# EAGLE board Motherboard (EAGLE 6.2), part 1 of 2
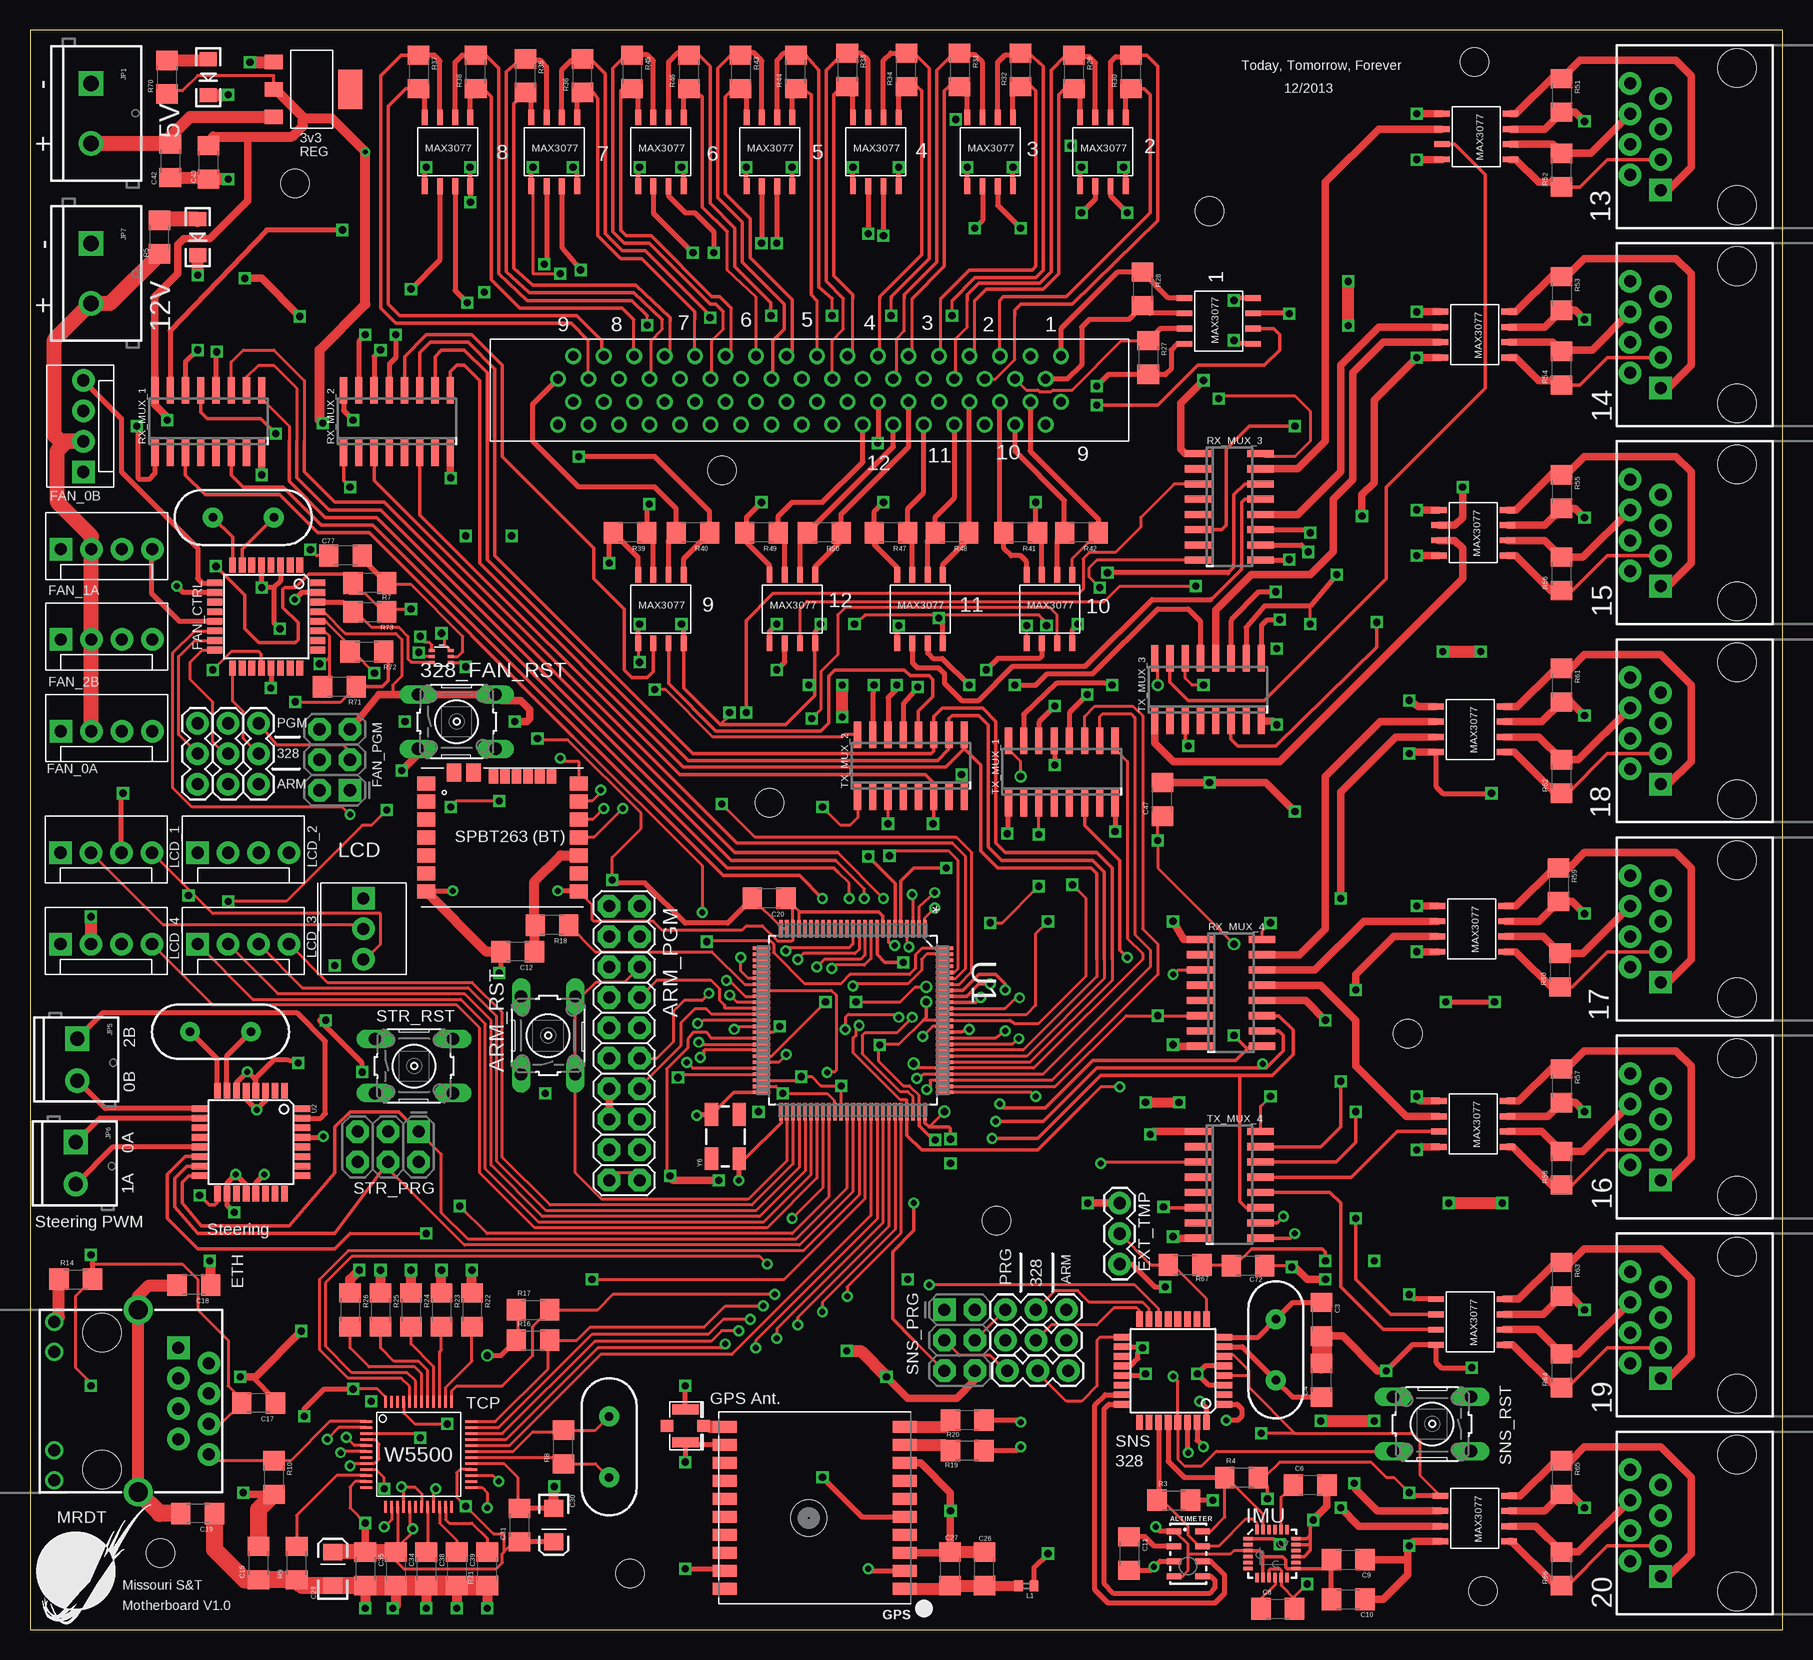
[diagram p9: board, top side]
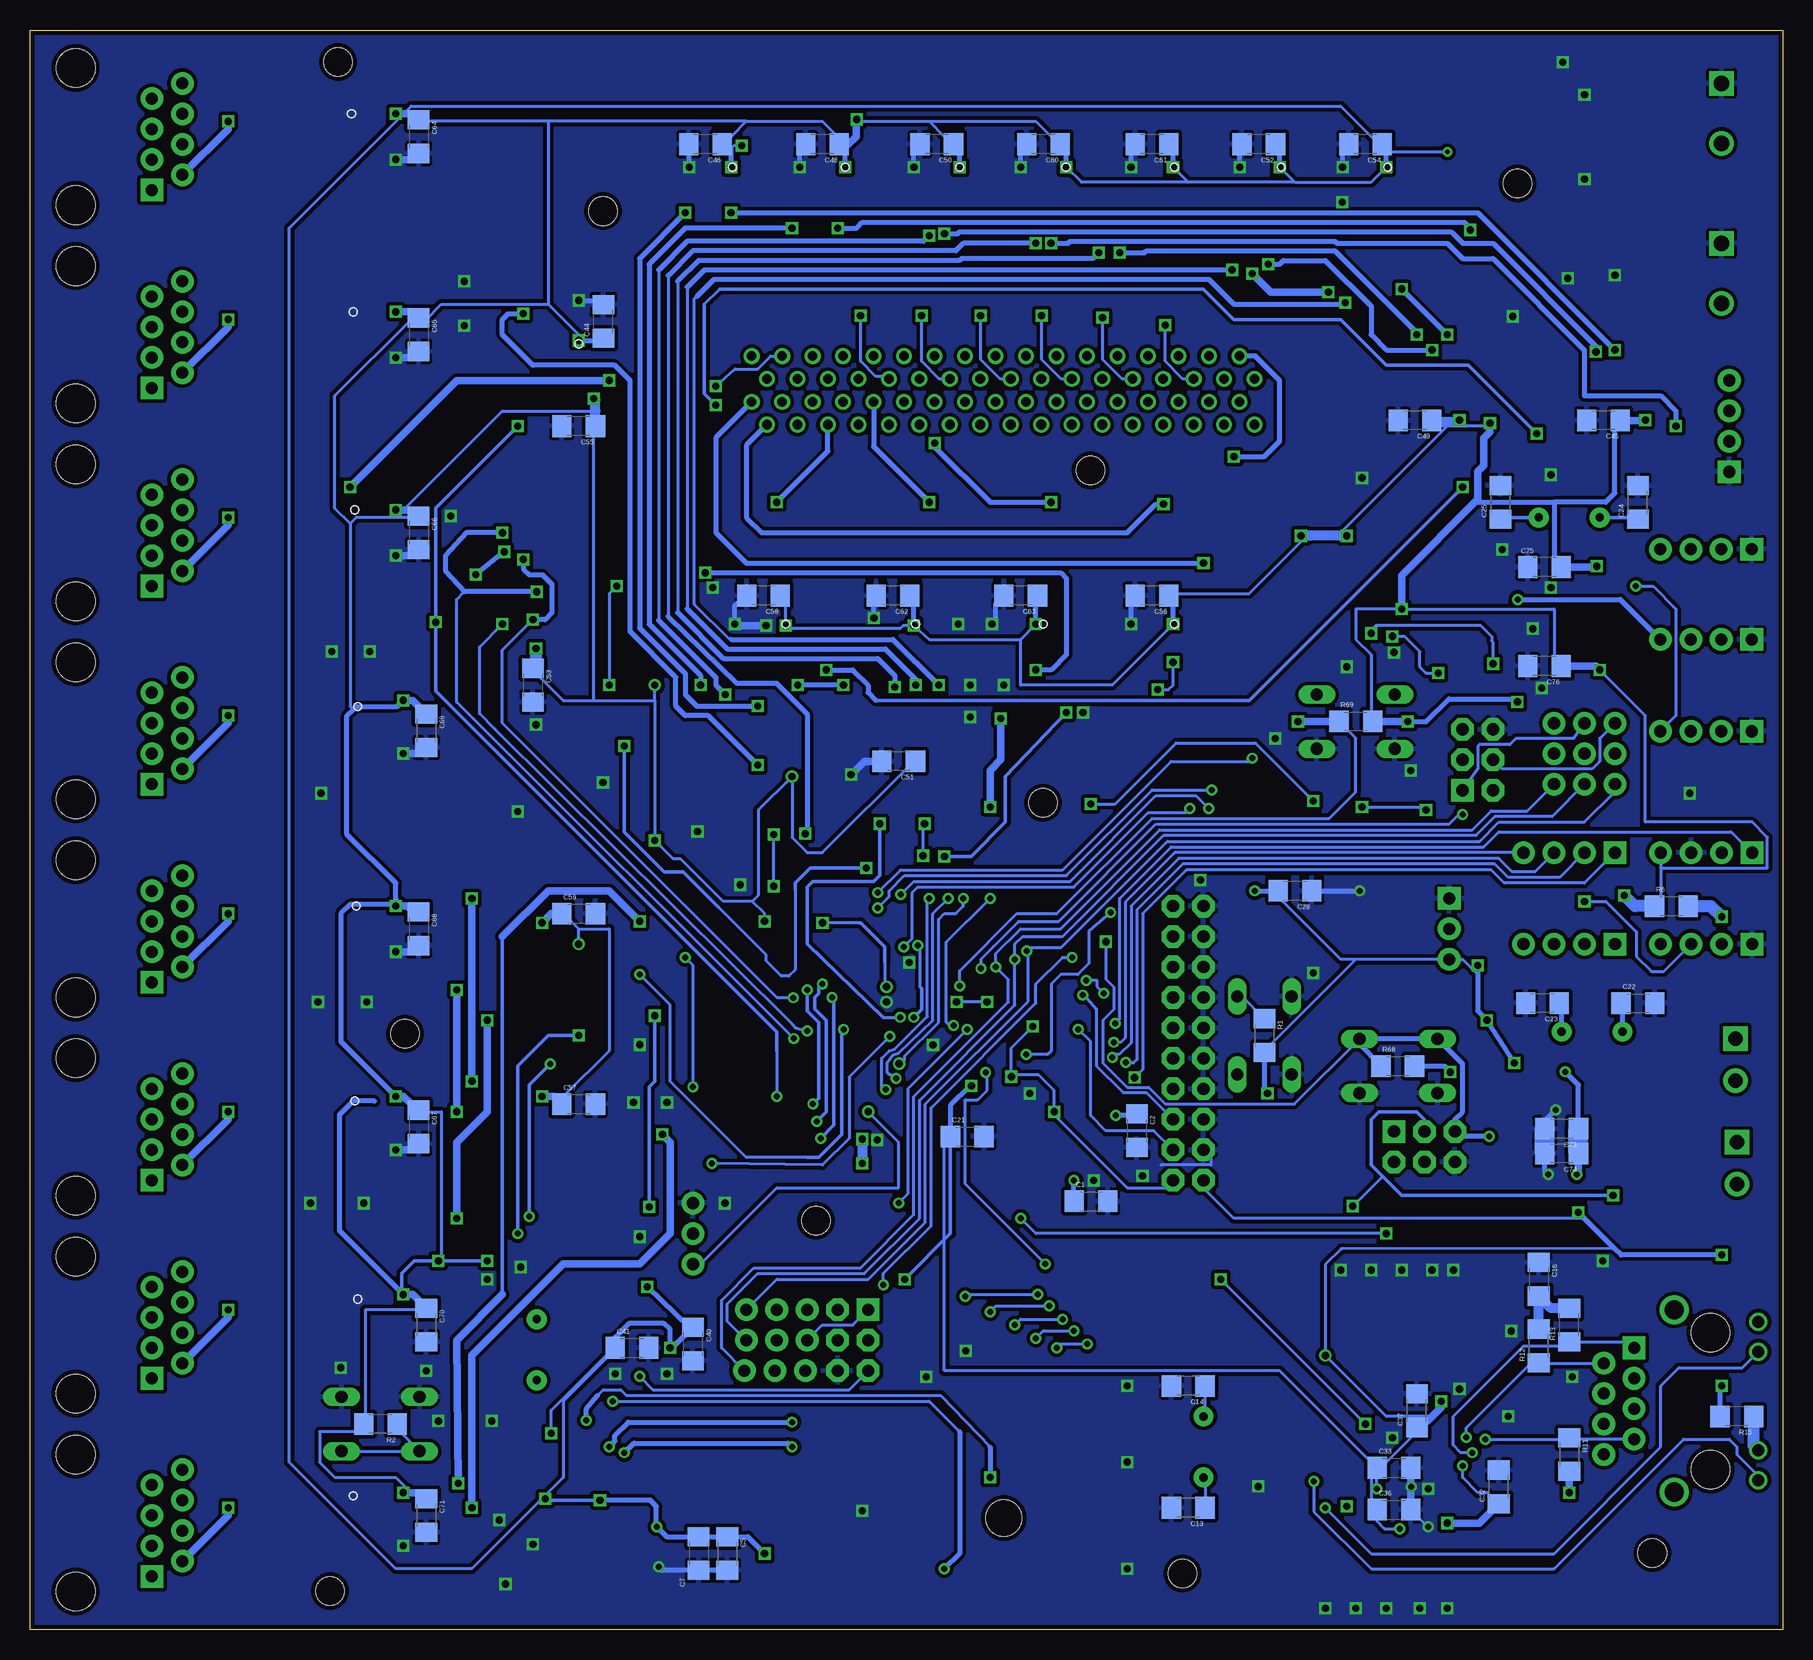
[diagram p10: board, bottom side, seen from below]

Size 146.05 x 133.35 mm. Coordinates in mm from the lower left corner, seen from the top.
Outline: 0,0 146.05,0 146.05,133.35 0,133.35 0,0
Copper layers (1*16): Top 0.035559375mm / dielectric 1.501140625mm / Bottom 0.035559375mm
Design rules "default": minimum track width 10mil, minimum drill 15mil, track to track 6mil, track to pad 6mil, pad to pad 6mil, via to via 6mil, smd to smd 6mil, copper to edge 15mil, drill to drill 8mil, minimum pad ring 10mil, minimum via ring 8mil, stop-mask expansion 4mil, vias tented up to drill 0mil, thermal gap 10mil
Holes 2.36 mm at 10.86,6.39 49.99,4.68 121.07,3.22 120.38,130.69 22.08,120.57 61.64,68.93 57.66,96.66 80.56,34.1 114.81,49.67 98.3,118.25
tRestrict: area 1,19.1 to 8.4,19.1

## Footprints (pad centres in the part's own frame; a part is rotated, then mirrored left to right if it is on the bottom)
B3F-10XX = drill 1.016 long: 1 -3.251,2.261; 2 3.251,2.261; 3 -3.251,-2.261; 4 3.251,-2.261
LGA8 = smd 1.2 x 0.5: 1 -1.2,1.875; 2 -1.2,0.625; 3 -1.2,-0.625; 4 -1.2,-1.875; 5 1.2,-1.875; 6 1.2,-0.625; 7 1.2,0.625; 8 1.2,1.875
SPBT2632C2A = smd 1.2 x 1.5: BOOT 3,6.37; CTS 0,6.37; GND 4.5,-6.37; GPIO1 -4.5,-6.37; GPIO2 -3,-6.37; GPIO3 -1.5,-6.37; GPIO4 0,-6.37; GPIO5 1.5,-6.37; GPIO6 3,-6.37; RESET 1.5,6.37; RTS -1.5,6.37; RXD -3,6.37; TXD -4.5,6.37; VIN 4.5,6.37 | smd 1.5 x 1.2: GPIO7 -5.4,-4.05; LPO -5.4,-2.4 | smd 1.2 x 0.8: NC -5.1,4.075; NC1 -5.1,3.11; NC2 -5.1,2.145; NC3 -5.1,1.18; NC4 -5.1,0.215; NC5 -5.1,-0.75
1206 = smd 1.6 x 1.8: 1 -1.4,0; 2 1.4,0
EIA3216 = smd 1.4 x 1.6: A 1.4,0; C -1.4,0
LED-1206 = smd 1.2 x 1.4: A -1.5,0; C 1.5,0
FGPMMOPA6H = smd 2 x 1: P$1 -7.5,6.75; P$2 -7.5,5.25; P$3 -7.5,3.75; P$4 -7.5,2.25; P$5 -7.5,0.75; P$6 -7.5,-0.75; P$7 -7.5,-2.25; P$8 -7.5,-3.75; P$9 -7.5,-5.25; P$10 -7.5,-6.75; P$11 7.5,-6.75; P$12 7.5,-5.25; P$13 7.5,-3.75; P$14 7.5,-2.25; P$15 7.5,-0.75; P$16 7.5,0.75; P$17 7.5,2.25; P$18 7.5,3.75; P$19 7.5,5.25; P$20 7.5,6.75 | hole 3: 0.5,0.85
QFN-24-NP = smd 0.8 x 0.3: 1 -2,1.25; 2 -2,0.75; 3 -2,0.25; 4 -2,-0.25; 5 -2,-0.75; 6 -2,-1.25; 13 2,-1.25; 14 2,-0.75; 15 2,-0.25; 16 2,0.25; 17 2,0.75; 18 2,1.25 | smd 0.3 x 0.8: 7 -1.25,-2; 8 -0.75,-2; 9 -0.25,-2; 10 0.25,-2; 11 0.75,-2; 12 1.25,-2; 19 1.25,2; 20 0.75,2; 21 0.25,2; 22 -0.25,2; 23 -0.75,2; 24 -1.25,2
2X3-NS = drill 1.016 pad 1.88 square: 1 -2.54,-1.27 | drill 1.016 pad 1.88 octagon: 2 -2.54,1.27; 3 0,-1.27; 4 0,1.27; 5 2.54,-1.27; 6 2.54,1.27
U.FL = smd 2.2 x 0.85: P$1 0,1.375; P$2 0,-1.375 | smd 1.05 x 1: P$3 1.525,0; P$4 -1.525,0
MAGJACK = drill 1 pad 1.88 square: 1 3.175,17.445 | drill 1 pad 1.88: 2 4.445,19.985; 3 5.715,17.445; 4 6.985,19.985; 5 8.255,17.445; 6 9.525,19.985; 7 10.795,17.445; 8 12.065,19.985 | drill 1 pad 1.27: 9 1,7.1; 10 3.5,7.1; 11 11.7,7.1; 12 14.2,7.1 | drill 1.6 pad 2.184: M1 0,14.1; M2 15.2,14.1 | hole 3.2: 1.905,11.095; 13.335,11.095
SCREWTERMINAL-5MM-2 = drill 1.3 pad 2.032 square: 1 0,0 | drill 1.3 pad 2.032: 2 5,0
1X03 = drill 1.016 pad 1.88: 1 0,0; 2 2.54,0; 3 5.08,0
MOLEX-1X4 = drill 1.016 pad 1.88 square: 1 0,0 | drill 1.016 pad 1.88: 2 2.54,0; 3 5.08,0; 4 7.62,0
SCREWTERMINAL-3.5MM-2 = drill 1.2 pad 2.032 square: 1 0,0 | drill 1.2 pad 2.032: 2 3.5,0
2X10 = drill 1.016 pad 1.88 octagon: 1 -11.43,-1.27; 2 -11.43,1.27; 3 -8.89,-1.27; 4 -8.89,1.27; 5 -6.35,-1.27; 6 -6.35,1.27; 7 -3.81,-1.27; 8 -3.81,1.27; 9 -1.27,-1.27; 10 -1.27,1.27; 11 1.27,-1.27; 12 1.27,1.27; 13 3.81,-1.27; 14 3.81,1.27; 15 6.35,-1.27; 16 6.35,1.27; 17 8.89,-1.27; 18 8.89,1.27; 19 11.43,-1.27; 20 11.43,1.27
0402 = smd 0.7 x 0.9: 1 -0.65,0; 2 0.65,0
MAX3070E = smd 0.49 x 1.3: A -1.905,2.857; B -0.635,2.857; DI 0.635,-2.857; GND 1.905,-2.857; RO -0.635,-2.857; VCC -1.905,-2.857; Y 1.905,2.857; Z 0.635,2.857
SOIC16N = smd 0.6 x 2.2: A 1.905,2.6; B 3.175,2.6; C 4.445,2.6; EN 1.905,-2.6; GND 4.445,-2.6; NC 3.175,-2.6; VCC -4.445,2.6; X -1.905,-2.6; X0 -0.635,2.6; X1 -1.905,2.6; X2 -3.175,2.6; X3 0.635,2.6; X4 -4.445,-2.6; X5 0.635,-2.6; X6 -3.175,-2.6; X7 -0.635,-2.6
QFP50P1600X1600X170-100N = smd 1.473 x 0.305: 1 -7.62,5.994; 2 -7.62,5.512; 3 -7.62,5.004; 4 -7.62,4.496; 5 -7.62,3.988; 6 -7.62,3.505; 7 -7.62,2.997; 8 -7.62,2.489; 9 -7.62,2.007; 10 -7.62,1.499; 11 -7.62,0.991; 12 -7.62,0.508; 13 -7.62,0; 14 -7.62,-0.508; 15 -7.62,-0.991; 16 -7.62,-1.499; 17 -7.62,-2.007; 18 -7.62,-2.489; 19 -7.62,-2.997; 20 -7.62,-3.505; 21 -7.62,-3.988; 22 -7.62,-4.496; 23 -7.62,-5.004; 24 -7.62,-5.512; 25 -7.62,-5.994; 51 7.62,-5.994; 52 7.62,-5.512; 53 7.62,-5.004; 54 7.62,-4.496; 55 7.62,-3.988; 56 7.62,-3.505; 57 7.62,-2.997; 58 7.62,-2.489; 59 7.62,-2.007; 60 7.62,-1.499; 61 7.62,-0.991; 62 7.62,-0.508; 63 7.62,0; 64 7.62,0.508; 65 7.62,0.991; 66 7.62,1.499; 67 7.62,2.007; 68 7.62,2.489; 69 7.62,2.997; 70 7.62,3.505; 71 7.62,3.988; 72 7.62,4.496; 73 7.62,5.004; 74 7.62,5.512; 75 7.62,5.994 | smd 0.305 x 1.473: 26 -5.994,-7.62; 27 -5.512,-7.62; 28 -5.004,-7.62; 29 -4.496,-7.62; 30 -3.988,-7.62; 31 -3.505,-7.62; 32 -2.997,-7.62; 33 -2.489,-7.62; 34 -2.007,-7.62; 35 -1.499,-7.62; 36 -0.991,-7.62; 37 -0.508,-7.62; 38 0,-7.62; 39 0.508,-7.62; 40 0.991,-7.62; 41 1.499,-7.62; 42 2.007,-7.62; 43 2.489,-7.62; 44 2.997,-7.62; 45 3.505,-7.62; 46 3.988,-7.62; 47 4.496,-7.62; 48 5.004,-7.62; 49 5.512,-7.62; 50 5.994,-7.62; 76 5.994,7.62; 77 5.512,7.62; 78 5.004,7.62; 79 4.496,7.62; 80 3.988,7.62; 81 3.505,7.62; 82 2.997,7.62; 83 2.489,7.62; 84 2.007,7.62; 85 1.499,7.62; 86 0.991,7.62; 87 0.508,7.62; 88 0,7.62; 89 -0.508,7.62; 90 -0.991,7.62; 91 -1.499,7.62; 92 -2.007,7.62; 93 -2.489,7.62; 94 -2.997,7.62; 95 -3.505,7.62; 96 -3.988,7.62; 97 -4.496,7.62; 98 -5.004,7.62; 99 -5.512,7.62; 100 -5.994,7.62
TQFP32-08 = smd 1.27 x 0.559: 1 -4.293,2.8; 2 -4.293,2; 3 -4.293,1.2; 4 -4.293,0.4; 5 -4.293,-0.4; 6 -4.293,-1.2; 7 -4.293,-2; 8 -4.293,-2.8; 17 4.293,-2.8; 18 4.293,-2; 19 4.293,-1.2; 20 4.293,-0.4; 21 4.293,0.4; 22 4.293,1.2; 23 4.293,2; 24 4.293,2.8 | smd 0.559 x 1.27: 9 -2.8,-4.293; 10 -2,-4.293; 11 -1.2,-4.293; 12 -0.4,-4.293; 13 0.4,-4.293; 14 1.2,-4.293; 15 2,-4.293; 16 2.8,-4.293; 25 2.8,4.293; 26 2,4.293; 27 1.2,4.293; 28 0.4,4.293; 29 -0.4,4.293; 30 -1.2,4.293; 31 -2,4.293; 32 -2.8,4.293
SOT563-2 = smd 0.508 x 0.249: 1 -0.8,0.498; 2 -0.8,0.003; 3 -0.8,-0.506; 4 0.776,-0.506; 5 0.776,0.003; 6 0.776,0.498
RJ45-8 = drill 1 pad 1.88 square: 1 -4.445,6.35 | drill 1 pad 1.88: 2 -3.175,8.89; 3 -1.905,6.35; 4 -0.635,8.89; 5 0.635,6.35; 6 1.905,8.89; 7 3.175,6.35; 8 4.445,8.89 | hole 3.2: -5.715,0; 5.715,0
LD1117SOT-223 = smd 3.3 x 2: (VOUT) 0,3.2 | smd 1.2 x 1.5: GND -2.3,-3.2; VIN 2.3,-3.2; VOUT 0,-3.2
3362U = drill 1.016 pad 1.88 square: P$1 0,2.54 | drill 1.016 pad 1.88: P$2 2.54,2.54; P$3 5.08,2.54
W5500 = smd 0.22 x 1: 1V20 1.75,-4.375; AGND2 -2.25,-4.375; AGND3 -1.25,-4.375; AGND4 0.25,-4.375; AGND5 -2.75,4.375; AVDD3 -1.75,-4.375; AVDD4 -0.75,-4.375; AVDD5 1.25,-4.375; NC2 -2.75,-4.375; NC3 -1.75,4.375; NC4 -2.25,4.375; PMODE0 -1.25,4.375; PMODE1 -0.75,4.375; PMODE2 -0.25,4.375; RSTN 2.75,4.375; RSVD 2.25,-4.375; RSVD2 2.25,4.375; RSVD3 1.75,4.375; RSVD4 1.25,4.375; RSVD5 0.75,4.375; RSVD6 0.25,4.375; SPDLED 2.75,-4.375; TOCAP 0.75,-4.375; VBG -0.25,-4.375 | smd 1 x 0.22: ACTLED 4.375,-1.75; AGND -4.375,1.75; AGND1 -4.375,-1.25; AVDD -4.375,1.25; AVDD1 -4.375,-0.75; AVDD2 -4.375,-2.25; DNC -4.375,-0.25; DUPLED 4.375,-2.25; EXRES1 -4.375,-1.75; GND 4.375,-0.75; INTN 4.375,2.75; LINKLED 4.375,-2.75; MISO 4.375,1.75; MOSI 4.375,2.25; NC -4.375,-2.75; RXN -4.375,0.75; RXP -4.375,0.25; SCLK 4.375,1.25; SCSN 4.375,0.75; TXN -4.375,2.75; TXP -4.375,2.25; VDD 4.375,-1.25; XI/CLKIN 4.375,-0.25; XO 4.375,0.25
60050685100 = drill 0.8: 1 47.555,7.107; 2 46.285,5.202; 3 45.015,7.107; 4 43.745,5.202; 5 42.475,7.107; 6 41.205,5.202; 7 39.935,7.107; 8 38.665,5.202; 9 37.395,7.107; 10 36.125,5.202; 11 34.855,7.107; 12 33.585,5.202; 13 32.315,7.107; 14 31.045,5.202; 15 29.775,7.107; 16 28.505,5.202; 17 27.235,7.107; 18 25.965,5.202; 19 24.695,7.107; 20 23.425,5.202; 21 22.155,7.107; 22 20.885,5.202; 23 19.615,7.107; 24 18.345,5.202; 25 17.075,7.107; 26 15.805,5.202; 27 14.535,7.107; 28 13.265,5.202; 29 11.995,7.107; 30 10.725,5.202; 31 9.455,7.107; 32 8.185,5.202; 33 6.915,7.107; 34 5.645,5.202; 35 47.555,3.297; 36 46.285,1.393; 37 45.015,3.297; 38 43.745,1.393; 39 42.475,3.297; 40 41.205,1.393; 41 39.935,3.297; 42 38.665,1.393; 43 37.395,3.297; 44 36.125,1.393; 45 34.855,3.297; 46 33.585,1.393; 47 32.315,3.297; 48 31.045,1.393; 49 29.775,3.297; 50 28.505,1.393; 51 27.235,3.297; 52 25.965,1.393; 53 24.695,3.297; 54 23.425,1.393; 55 22.155,3.297; 56 20.885,1.393; 57 19.615,3.297; 58 18.345,1.393; 59 17.075,3.297; 60 15.805,1.393; 61 14.535,3.297; 62 13.265,1.393; 63 11.995,3.297; 64 10.725,1.393; 65 9.455,3.297; 66 8.185,1.393; 67 6.915,3.297; 68 5.645,1.393
HC49US = drill 0.7 pad 1.651: 1 -2.54,0; 2 2.54,0
CRYSTAL-SMD-5X3 = smd 1.9 x 1.1: 1 -1.85,-1.15; 2 1.85,-1.15; 3 1.85,1.15; 4 -1.85,1.15

## Placement (x,y rotation side)
328_FAN_RST  [B3F-10XX]  35.56,75.69 0 top
328_RST  [B3F-10XX]  116.84,17.14 180 top
328_STR_RST  [B3F-10XX]  32,46.99 0 top
ALTIMETER  MPL3115A2LGA8  [LGA8]  96.52,6.35 0 top
ARM_RST  [B3F-10XX]  43.18,49.53 90 top
BLUETOOTH  SPBT2632C2A  [SPBT2632C2A]  39.37,66.04 270 top
C1  20pF  [1206]  57.63,35.72 0 bottom
C2  20pF  [1206]  53.82,41.59 270 bottom
C3  22pF  [1206]  107.63,25.88 270 top
C4  22pF  [1206]  107.63,20.8 90 top
C5  100nF  [1206]  87.95,6.35 270 bottom
C6  2.2nF  [1206]  106.68,12.06 0 top
C7  10uF  [1206]  90.33,6.35 270 bottom
C8  0.1uF  [1206]  103.98,1.75 0 top
C9  10nF  [1206]  109.86,5.84 0 top
C10  0.1uF  [1206]  109.86,2.54 0 top
C11  100nF  [1206]  91.6,6.35 270 top
C12  0.1uF  [1206]  40.64,56.52 180 top
C13  18pF  [1206]  49.53,10.16 180 bottom
C14  18pF  [1206]  49.53,20.32 180 bottom
C15  .1uF  [1206]  19.05,5.56 90 top
C16  .1uF  [1206]  20.32,29.21 270 bottom
C17  .1uF  [1206]  19.05,18.89 180 top
C18  .1uF  [1206]  13.65,28.73 180 top
C19  .1uF  [1206]  13.97,9.68 180 top
C20  0.1uF  [1206]  61.59,60.96 180 top
C21  0.1uF  [1206]  67.94,41.12 0 bottom
C22  22pF  [1206]  12.06,52.23 0 bottom
C23  22pF  [1206]  20,52.23 180 bottom
C24  22pF  [1206]  12.06,93.98 90 bottom
C25  22pF  [1206]  23.5,93.98 90 bottom
C26  1uF  [1206]  79.53,5.08 90 top
C27  0.01uF  [1206]  76.68,5.08 90 top
C28  0.1uF  [1206]  40.64,61.59 180 bottom
C29  10uF/16V  [EIA3216]  25.24,5.08 90 top
C30  10uF/16V  [EIA3216]  43.66,8.73 270 top
C31  0.1uF  [1206]  40.8,8.73 90 top
C32  0.1uF  [1206]  23.65,11.91 90 bottom
C33  0.1uF  [1206]  32.38,13.49 0 bottom
C34  0.1uF  [1206]  30.48,5.08 270 top
C35  0.1uF  [1206]  27.94,5.08 270 top
C36  0.1uF  [1206]  32.38,10 0 bottom
C37  0.1uF  [1206]  30.48,18.26 90 bottom
C38  4.7uF  [1206]  33.02,5.08 270 top
C39  10nF  [1206]  35.56,5.08 270 top
C40  0.1uF  [1206]  90.81,23.81 270 bottom
C41  0.1uF  [1206]  95.89,23.5 0 bottom
C42  100nF  [1206]  11.68,122.43 270 top
C43  10uF  [1206]  14.86,122.3 270 top
C44  0.1uF  [1206]  98.27,109.06 90 bottom
C45  0.1uF  [1206]  14.92,100.81 180 bottom
C46  0.1uF  [1206]  89.76,123.83 180 bottom
C47  0.1uF  [1206]  94.36,69.22 90 top
C48  0.1uF  [1206]  80.01,123.83 180 bottom
C49  0.1uF  [1206]  30.64,100.81 180 bottom
C50  0.1uF  [1206]  70.48,123.83 180 bottom
C51  0.1uF  [1206]  73.66,72.39 180 bottom
C52  0.1uF  [1206]  43.66,123.83 180 bottom
C53  0.1uF  [1206]  104.14,78.74 270 bottom
C54  0.1uF  [1206]  34.77,123.83 180 bottom
C55  0.1uF  [1206]  100.33,100.33 180 bottom
C56  0.1uF  [1206]  52.55,86.2 180 bottom
C57  0.1uF  [1206]  100.33,43.81 0 bottom
C58  0.1uF  [1206]  84.93,86.2 180 bottom
C59  0.1uF  [1206]  100.33,59.69 0 bottom
C60  0.1uF  [1206]  61.59,123.83 180 bottom
C61  0.1uF  [1206]  52.55,123.83 180 bottom
C62  0.1uF  [1206]  74.14,86.2 180 bottom
C63  0.1uF  [1206]  63.5,86.2 180 bottom
C64  0.1uF  [1206]  113.67,124.46 270 bottom
C65  0.1uF  [1206]  113.67,107.95 270 bottom
C66  0.1uF  [1206]  113.67,91.44 270 bottom
C67  0.1uF  [1206]  113.67,41.91 270 bottom
C68  0.1uF  [1206]  113.67,58.42 270 bottom
C69  0.1uF  [1206]  113.03,74.93 270 bottom
C70  0.1uF  [1206]  113.03,25.4 270 bottom
C71  0.1uF  [1206]  113.03,9.53 270 bottom
C72  100nF  [1206]  101.49,30.36 0 top
C73  0.1uF  [1206]  18.41,41.75 180 bottom
C74  0.1uF  [1206]  18.41,39.69 180 bottom
C75  0.1uF  [1206]  19.84,88.58 180 bottom
C76  0.1uF  [1206]  19.84,80.33 180 bottom
C77  0.1uF  [1206]  26.29,89.53 180 top
D1  GREEN  [LED-1206]  14.86,129.41 270 top
D2  GREEN  [LED-1206]  13.97,116.08 270 top
GPS  [FGPMMOPA6H]  65.41,10.16 180 top
IMU  [QFN-24-NP]  103.5,6.35 0 top
J1  AVR_SPI_PRG_6NS  [2X3-NS]  77.47,24.13 270 top
J2  U.FL  [U.FL]  54.61,16.99 0 top
J3  MAGJACK  [MAGJACK]  -5.08,26.67 270 top
J4  AVR_SPI_PRG_6NS  [2X3-NS]  29.84,40.26 180 top
J5  AVR_SPI_PRG_6NS  [2X3-NS]  25.4,72.52 90 top
JP1  M025MM  [SCREWTERMINAL-5MM-2]  5.08,128.91 270 top
JP2  [1X03]  90.81,35.56 270 top
JP3  [MOLEX-1X4]  2.54,64.77 0 top
JP4  [MOLEX-1X4]  2.57,90.07 0 top
JP5  M023.5MM  [SCREWTERMINAL-3.5MM-2]  3.94,49.28 270 top
JP6  M023.5MM  [SCREWTERMINAL-3.5MM-2]  3.81,40.64 270 top
JP7  M025MM  [SCREWTERMINAL-5MM-2]  5.08,115.57 270 top
JP8  [MOLEX-1X4]  2.57,74.9 0 top
JP9  [MOLEX-1X4]  13.97,64.77 0 top
JP10  [MOLEX-1X4]  2.57,82.55 0 top
JP11  [MOLEX-1X4]  4.45,96.52 90 top
JP12  [MOLEX-1X4]  13.97,57.15 0 top
JP13  [MOLEX-1X4]  2.54,57.15 0 top
JP15  JUMPER-3PTH  [1X03]  16.51,70.48 90 top
JP16  JUMPER-3PTH  [1X03]  13.97,70.48 90 top
JP17  JUMPER-3PTH  [1X03]  19.05,70.48 90 top
JP18  JUMPER-3PTH  [1X03]  86.36,26.67 180 top
JP19  JUMPER-3PTH  [1X03]  86.36,24.13 180 top
JP20  JUMPER-3PTH  [1X03]  86.52,21.59 180 top
JTAG_CON  M10X2  [2X10]  49.53,48.9 90 top
L1  BML15HB121SN1  [0402]  83.03,3.65 180 top
R1  10k  [1206]  43.18,49.53 270 bottom
R2  10k  [1206]  116.84,17.14 180 bottom
R3  10k  [1206]  95.31,10.79 0 top
R4  10k  [1206]  100.97,12.7 0 top
R5  330  [1206]  10.79,116.08 90 top
R6  100  [1206]  9.27,60.33 0 bottom
R7  1k  [1206]  28.32,87.25 180 top
R8  1M  [1206]  44.45,15.24 90 top
R9  12.4K  [1206]  22.23,5.56 90 top
R10  51  [1206]  20.32,12.7 270 top
R11  51  [1206]  17.78,14.61 270 bottom
R12  51  [1206]  20.32,23.65 90 bottom
R13  51  [1206]  17.78,25.4 90 bottom
R14  200  [1206]  3.81,29.21 0 top
R15  200  [1206]  3.81,17.78 180 bottom
R16  10K  [1206]  41.91,24.13 0 top
R17  10K  [1206]  41.91,26.67 0 top
R18  10k  [1206]  43.5,58.74 180 top
R19  330  [1206]  78.11,14.92 180 top
R20  330  [1206]  78.11,17.46 180 top
R21  10k  [1206]  38.1,5.08 90 top
R22  10k  [1206]  36.83,26.67 270 top
R23  10k  [1206]  34.29,26.67 270 top
R24  10k  [1206]  31.75,26.67 270 top
R25  10k  [1206]  29.21,26.67 270 top
R26  10k  [1206]  26.67,26.67 270 top
R27  120  [1206]  93.19,106.05 270 top
R28  120  [1206]  92.71,111.76 270 top
R29  120  [1206]  87,129.86 270 top
R30  120  [1206]  91.76,129.86 90 top
R31  120  [1206]  77.47,130.02 270 top
R32  120  [1206]  82.55,130.02 90 top
R33  120  [1206]  68.1,130.02 270 top
R34  120  [1206]  73.03,130.02 90 top
R35  120  [1206]  41.27,129.54 270 top
R36  120  [1206]  46.04,129.54 90 top
R37  120  [1206]  32.38,129.86 270 top
R38  120  [1206]  37.15,129.86 90 top
R39  120  [1206]  50.01,91.44 180 top
R40  120  [1206]  55.24,91.44 180 top
R41  120  [1206]  82.55,91.44 180 top
R42  120  [1206]  87.63,91.44 180 top
R43  120  [1206]  59.21,129.86 270 top
R44  120  [1206]  63.82,129.86 90 top
R45  120  [1206]  50.16,129.86 270 top
R46  120  [1206]  54.93,129.86 90 top
R47  120  [1206]  71.75,91.44 180 top
R48  120  [1206]  76.83,91.44 180 top
R49  120  [1206]  60.96,91.44 180 top
R50  120  [1206]  66.2,91.44 180 top
R51  120  [1206]  127.64,127.89 270 top
R52  120  [1206]  127.64,121.67 90 top
R53  120  [1206]  127.64,111.38 270 top
R54  120  [1206]  127.64,105.16 90 top
R55  120  [1206]  127.64,94.87 270 top
R56  120  [1206]  127.64,88.01 90 top
R57  120  [1206]  127.64,45.34 270 top
R58  120  [1206]  127.64,38.48 90 top
R59  120  [1206]  127.38,62.1 270 top
R60  120  [1206]  127.51,54.99 90 top
R61  120  [1206]  127.64,78.74 270 top
R62  120  [1206]  127.64,71.12 90 top
R63  120  [1206]  127.64,29.21 270 top
R64  120  [1206]  127.64,21.59 90 top
R65  120  [1206]  127.64,12.7 270 top
R66  120  [1206]  127.64,5.08 90 top
R67  1K  [1206]  96.27,30.42 0 top
R68  10k  [1206]  32.07,46.99 0 bottom
R69  10k  [1206]  35.56,75.72 0 bottom
R70  330  [1206]  11.43,129.41 90 top
R71  1k  [1206]  25.78,78.61 0 top
R72  1k  [1206]  28.07,81.53 0 top
R73  1k  [1206]  28.32,84.84 0 top
RS-485-1  MAX3077  [MAX3070E]  120.52,124.46 270 top
RS-485-2  MAX3077  [MAX3070E]  120.4,107.95 270 top
RS-485-3  MAX3077  [MAX3070E]  120.27,91.44 270 top
RS-485-4  MAX3077  [MAX3070E]  120.27,42.16 270 top
RS-485-5  MAX3077  [MAX3070E]  120.14,58.42 270 top
RS-485-6  MAX3077  [MAX3070E]  120.02,75.06 270 top
RS-485-7  MAX3077  [MAX3070E]  120.02,25.65 270 top
RS-485-8  MAX3077  [MAX3070E]  120.4,9.27 270 top
RS_TRANS_1  MAX3077  [MAX3070E]  99.06,109.09 90 top
RS_TRANS_2  MAX3077  [MAX3070E]  89.41,123.19 0 top
RS_TRANS_3  MAX3077  [MAX3070E]  80.01,123.19 0 top
RS_TRANS_4  MAX3077  [MAX3070E]  70.48,123.19 0 top
RS_TRANS_5  MAX3077  [MAX3070E]  43.69,123.19 0 top
RS_TRANS_6  MAX3077  [MAX3070E]  34.8,123.19 0 top
RS_TRANS_7  MAX3077  [MAX3070E]  52.58,85.09 0 top
RS_TRANS_8  MAX3077  [MAX3070E]  84.96,85.09 0 top
RS_TRANS_9  MAX3077  [MAX3070E]  61.63,123.19 0 top
RS_TRANS_10  MAX3077  [MAX3070E]  52.58,123.19 0 top
RS_TRANS_11  MAX3077  [MAX3070E]  74.17,85.09 0 top
RS_TRANS_12  MAX3077  [MAX3070E]  63.53,85.09 0 top
RX_MUX_1  8:1 Mux  [SOIC16N]  14.86,100.71 0 top
RX_MUX_2  8:1 Mux  [SOIC16N]  30.58,100.71 0 top
RX_MUX_3  8:1 Mux  [SOIC16N]  99.95,93.6 270 top
RX_MUX_4  8:1 Mux  [SOIC16N]  100.08,53.09 270 top
TX_MUX_1  8:1 Mux  [SOIC16N]  85.98,71.5 0 top
TX_MUX_2  8:1 Mux  [SOIC16N]  73.41,72.01 0 top
TX_MUX_3  8:1 Mux  [SOIC16N]  98.17,78.36 0 top
TX_MUX_4  8:1 Mux  [SOIC16N]  99.95,37.08 270 top
U1  MK10DN512ZVLL10  [QFP50P1600X1600X170-100N]  68.58,50.8 270 top
U2  ATMEGA328P  [TQFP32-08]  18.41,40.64 270 top
U3  ATMEGA328P  [TQFP32-08]  95.25,21.59 180 top
U4  ATMEGA328P  [TQFP32-08]  19.68,84.45 270 top
U5  TMP1021:1  [SOT563-2]  34.29,81.12 0 top
U$1  RJ45-8PTH  [RJ45-8]  142.24,124.46 90 top
U$2  LD1117  [LD1117SOT-223]  23.5,128.4 270 top
U$3  RJ45-8PTH  [RJ45-8]  142.24,107.95 90 top
U$4  RJ45-8PTH  [RJ45-8]  142.24,91.44 90 top
U$5  RJ45-8PTH  [RJ45-8]  142.24,41.91 90 top
U$6  RJ45-8PTH  [RJ45-8]  142.24,58.42 90 top
U$7  RJ45-8PTH  [RJ45-8]  142.24,74.93 90 top
U$8  RJ45-8PTH  [RJ45-8]  142.24,25.4 90 top
U$9  RJ45-8PTH  [RJ45-8]  142.24,8.89 90 top
U$10  10k  [3362U]  25.24,60.96 270 top
U$11  W5500  [W5500]  32.38,14.61 0 top
U$36  TB60050685100  [60050685100]  38.35,99.06 0 top
Y2  8MHz  [HC49US]  103.82,23.34 270 top
Y3  25MHz  [HC49US]  48.26,15.24 270 top
Y4  8MHz  [HC49US]  15.88,49.85 0 top
Y5  8MHz  [HC49US]  17.78,92.71 0 top
Y6  32MHz  [CRYSTAL-SMD-5X3]  57.94,41.12 90 top

## Tracks (layer width: path | path; a pad name or v marks a point on that pad's centre or on a via)
1_RX+  (via drill 0.6)
  Top 0.254: R27.2 92.42,104.93
  Top 0.406: RS_TRANS_1.A 95.6,107.19 95.09,106.68 95.09,105.09 94.61,104.62 93.22,104.62 R27.2 89.88,104.64 v88.9,103.66
  Bottom 0.254: v88.9,103.66 87.31,105.09 85.41,105.09 84.33,106.17 U$36.3
1_RX-
  Top 0.254: U$36.4 83.02,103.35 83.98,103.35 84.14,103.19 85.09,103.19 85.25,103.35 86.84,103.35 90.94,107.44 R27.1
  Top 0.406: RS_TRANS_1.B 94.2,108.46 R27.1
1_TX+
  Top 0.406: RS_TRANS_1.Y 94.87,111 R28.1 90.62,113.16 85.91,108.45 U$36.1
1_TX-
  Top 0.406: RS_TRANS_1.Z 93.34,109.73 R28.2 91.57,109.22 88.27,109.22 87.63,108.58 87.63,105.41 86.45,104.26 U$36.2
2_RX+
  Top 0.254: U$36.7 78.74,106.62 78.74,110.81
  Top 0.305: 78.74,110.81 79.69,111.76 84.45,111.76 85.72,113.03 85.72,127.95 86.23,128.46 R29.2
  Top 0.406: RS_TRANS_2.A 87.5,127.95 R29.2
2_RX-
  Top 0.254: U$36.8 77.15,104.4 77.15,107.63 78.11,108.58 78.11,110.81
  Top 0.305: 78.11,110.81 78.11,111.28 79.06,112.24 84.14,112.24 85.09,113.19 85.09,130.02 86.33,131.26 R29.1
  Top 0.406: RS_TRANS_2.B 88.77,130.62 88.27,131.13 87.12,131.13 R29.1
2_TX+
  Top 0.254: U$36.5 80.8,106.19 80.8,110.81
  Top 0.305: 80.8,110.81 81.12,111.12 86.36,111.12 93.34,118.11 93.34,127.95 92.84,128.46 R30.1
  Top 0.406: RS_TRANS_2.Y 91.31,128.01 R30.1
2_TX-
  Top 0.254: U$36.6 80.45,104.26 82.07,105.89 82.07,109.54
  Top 0.305: 82.07,109.54 82.07,110.01 82.55,110.49 86.84,110.49 93.98,117.47 93.98,130.33 93.06,131.26 R30.2
  Top 0.406: RS_TRANS_2.Z 90.04,130.68 90.49,131.13 91.63,131.13 R30.2
3_RX+
  Top 0.254: U$36.11 73.5,106.51 73.5,110.97
  Top 0.305: 73.5,110.97 76.2,113.67 76.2,128.27 76.55,128.62 R31.2
  Top 0.406: RS_TRANS_3.A 78.11,127.98 R31.2
3_RX-
  Top 0.254: U$36.12 72.23,104.61 72.23,107.63 72.87,108.27 72.87,110.97
  Top 0.305: 72.87,110.97 72.87,111.28 75.56,113.98 75.56,130.02 76.68,131.13 77.18,131.13 R31.1
  Top 0.406: R31.1 77.6,131.29 78.74,131.29 79.38,130.65 RS_TRANS_3.B
3_TX+
  Top 0.254: U$36.9 75.88,106.3 75.88,110.97
  Top 0.305: 75.88,110.97 78.26,113.35 83.5,113.35 83.82,113.67 83.82,128.27 83.47,128.62 R32.1
  Top 0.406: RS_TRANS_3.Y 81.92,127.98 R32.1
3_TX-  (via drill 0.6)
  Top 0.254: 82.68,131.29 R32.2 | v76.83,109.54 76.83,110.81
  Top 0.305: 76.83,110.81 78.74,112.71 83.82,112.71 84.45,113.35 84.45,130.33 83.21,131.42 R32.2
  Top 0.406: RS_TRANS_3.Z 80.64,130.65 81.28,131.29 82.42,131.29 R32.2
  Bottom 0.254: U$36.10 74.67,104.46 75.56,104.46 76.83,105.73 v76.83,109.54
4_RX+
  Top 0.254: U$36.15 68.58,106.62 68.58,110.97
  Top 0.305: 68.58,110.97 68.58,111.28 66.99,112.87 66.99,127.95 67.31,128.27 67.76,128.27 R33.2
  Top 0.406: RS_TRANS_4.A 68.58,128.14 R33.2
4_RX-
  Top 0.254: U$36.16 66.83,104.29 66.83,107.47 67.79,108.43 67.79,110.97
  Top 0.305: 67.79,110.97 66.36,112.39 66.36,130.02 67.76,131.42 R33.1
  Top 0.406: RS_TRANS_4.B 69.85,130.81 69.24,131.42 R33.1
4_TX+
  Top 0.254: U$36.13 70.8,106.3 70.8,110.97
  Top 0.305: 70.8,110.97 70.8,111.12 74.3,114.62 74.3,128.27 73.95,128.62 R34.1
  Top 0.406: RS_TRANS_4.Y 72.39,127.98 R34.1
4_TX-  (via drill 0.6)
  Top 0.254: v71.75,109.54 71.75,110.97
  Top 0.305: 71.75,110.97 71.75,111.12 74.93,114.3 74.93,130.18 73.69,131.42 R34.2
  Top 0.406: RS_TRANS_4.Z 71.12,130.81 71.73,131.42 R34.2
  Bottom 0.254: U$36.14 70.29,104.26 71.75,105.73 v71.75,109.54
5_RX+
  Top 0.305: U$36.19 63.5,106.62 63.5,110.87 60.01,114.36 60.01,117.63 57.94,119.7 57.94,127.79 58.61,128.46 R43.2
  Top 0.406: RS_TRANS_9.A 59.72,127.95 R43.2
5_RX-
  Top 0.305: U$36.20 61.91,104.4 61.91,107.47 62.87,108.43 62.87,110.01 62.87,110.49 59.37,113.98 59.37,117.32 57.31,119.38 57.31,130.18 58.39,131.26 R43.1
  Top 0.406: RS_TRANS_9.B 60.99,130.78 60.33,131.44 59.4,131.44 R43.1 59.66,130.81
5_TX+
  Top 0.254: U$36.17 65.59,110.78 65.56,110.81
  Top 0.305: 65.56,110.81 65.09,111.28 65.09,127.95 64.61,128.27 64,128.27 R44.1
  Top 0.406: RS_TRANS_9.Y 63.53,128.17 R44.1
5_TX-  (via drill 0.6)
  Top 0.254: v66.83,109.54 66.83,110.97
  Top 0.305: 66.83,110.97 65.72,111.92 65.72,130.02 64.64,131.26 R44.2
  Top 0.406: RS_TRANS_9.Z 62.26,130.84 62.87,131.44 63.63,131.44 R44.2
  Bottom 0.254: U$36.18 65.21,104.26 66.83,105.89 v66.83,109.54
6_RX+
  Top 0.254: U$36.23 58.42,106.62 58.42,110.17
  Top 0.305: 58.42,110.17 57.47,111.12 56.83,111.12 51.75,116.2 49.69,116.2 49.21,116.68 49.21,128.27 49.4,128.46 R45.2
  Top 0.406: RS_TRANS_10.A 50.67,127.95 R45.2
6_RX-
  Top 0.254: U$36.24 56.83,104.4 56.83,107.47 57.78,108.43 57.78,109.86
  Top 0.305: 57.78,109.86 57.15,110.49 56.67,110.49 51.59,115.57 49.53,115.57 48.58,116.52 48.58,130.18 49.66,131.26 R45.1
  Top 0.406: RS_TRANS_10.B 51.94,130.78 51.44,131.29 50.19,131.29 R45.1
6_TX+
  Top 0.254: U$36.21 60.51,111.1 58.1,113.35 58.1,116.52
  Top 0.305: 58.1,116.52 56.04,118.59 56.04,127.79 55.22,128.46 R46.1
  Top 0.406: RS_TRANS_10.Y 54.48,128.01 R46.1
6_TX-  (via drill 0.6)
  Top 0.305: R46.2 55.75,131.26 56.67,130.33 56.67,118.9 58.74,116.84 58.74,113.6 61.72,110.62 61.72,109.57 v61.75,109.54
  Top 0.406: RS_TRANS_10.Z 53.21,130.68 53.98,131.44 54.74,131.44 R46.2
  Bottom 0.254: U$36.22 60.13,104.26 61.75,105.89 v61.75,109.54
7_RX+
  Top 0.254: U$36.27 53.34,106.62 53.34,109.06
  Top 0.305: 53.34,109.06 53.34,109.38 50.48,112.08 41.91,112.08 40.32,113.51 40.32,127.19 R35.2
  Top 0.406: RS_TRANS_5.A 41.78,127.63 R35.2
7_RX-
  Top 0.254: U$36.28 51.75,104.4 51.75,107.47 52.7,108.43 52.7,109.22
  Top 0.305: 52.7,109.22 50.32,111.44 41.59,111.44 39.69,113.19 39.69,129.86 40.93,130.94 R35.1
  Top 0.406: RS_TRANS_5.B 43.05,130.3 42.55,130.81 41.41,130.81 R35.1
7_TX+
  Top 0.254: U$36.25 55.4,106.19 55.4,109.22
  Top 0.305: 55.4,109.22 55.4,109.86 50.96,114.3 49.21,114.3 47.31,116.2 47.31,127.64 46.96,128.14 R36.1
  Top 0.406: RS_TRANS_5.Y 45.59,127.69 R36.1
7_TX-  (via drill 0.6)
  Top 0.254: v56.67,109.38 56.52,109.7
  Top 0.305: 56.52,109.7 51.28,114.94 49.37,114.94 47.94,116.36 47.94,129.7 46.7,130.94 R36.2
  Top 0.406: RS_TRANS_5.Z 44.32,130.05 45.09,130.81 45.91,130.81 R36.2
  Bottom 0.254: U$36.26 55.05,104.26 56.67,105.89 v56.67,109.38
8_RX+
  Top 0.305: R37.2 31.3,128.46 29.84,127 29.84,110.49 30.8,109.54 45.56,109.54 47.62,107.47 47.62,106.35 U$36.31
  Top 0.406: RS_TRANS_6.A 32.89,127.95 R37.2
8_RX-
  Top 0.254: U$36.32 46.51,104.29 46.51,107.47
  Top 0.305: R37.1 30.93,131.26 29.21,129.54 29.21,110.17 30.48,108.9 45.09,108.9 46.51,107.47
  Top 0.406: RS_TRANS_6.B 34.16,130.78 33.68,131.26 R37.1
8_TX+
  Top 0.254: U$36.29 50.32,106.19 50.32,109.22
  Top 0.305: 50.32,109.22 49.37,110.17 40.8,110.17 38.42,112.55 38.42,127.79 37.75,128.46 R38.1
  Top 0.406: RS_TRANS_6.Y 36.7,128.01 R38.1
8_TX-  (via drill 0.6)
  Top 0.254: v51.44,108.74 51.44,109.54
  Top 0.305: 51.44,109.54 50.16,110.81 41.43,110.81 39.05,113.03 39.05,130.18 37.97,131.26 R38.2
  Top 0.406: RS_TRANS_6.Z 35.43,130.68 36.01,131.26 R38.2
  Bottom 0.254: U$36.30 49.97,104.26 51.44,105.73 v51.44,108.74
9_RX+  (via drill 0.6)
  Top 0.406: RS_TRANS_7.A 50.67,89.37 R39.2 48.26,91.44 v48.26,88.9
  Bottom 0.406: U$36.35 88.9,99.37 88.9,91.44 86.36,88.9 v48.26,88.9
9_RX-  (via drill 0.6)
  Top 0.406: RS_TRANS_7.B 51.94,90.9 R39.1 51.41,93.63 v51.59,93.82
  Bottom 0.406: U$36.36 86.36,98.73 86.36,92.71 85.09,91.44 54.61,91.44 52.23,93.82 v51.59,93.82
9_TX+  (via drill 0.6)
  Top 0.406: RS_TRANS_7.Y 54.48,89.28 R40.1 56.65,93.22 52.07,97.79 v45.72,97.79
  Bottom 0.406: v45.72,97.79 43.18,97.79 41.91,99.06 41.91,104.14 43.94,106.17 U$36.33
9_TX-
  Top 0.406: RS_TRANS_7.Z 53.21,90.81 R40.2 53.84,93.47 52.07,95.25 45.72,95.25 41.91,99.06 41.91,102.17 U$36.34
10_RX+
  Top 0.406: RS_TRANS_8.A 83.06,89.03 82.55,89.53 81.76,89.53 81.15,90.14 R41.2 80.83,91.76 U$36.39
10_RX-  (via drill 0.6)
  Top 0.406: RS_TRANS_8.B 84.33,91.06 R41.1 83.82,91.57 v83.82,93.98
  Bottom 0.406: v83.82,93.98 79.56,98.24 U$36.40
10_TX+
  Top 0.254: RS_TRANS_8.Y 86.87,89.28 R42.1
  Top 0.406: U$36.37 83.34,102.33 83.34,98.27 89.03,92.58 R42.1
10_TX-
  Top 0.406: RS_TRANS_8.Z 85.6,90.81 R42.2 86.2,91.47 86.2,94.14 82.1,98.24 U$36.38
11_RX+  (via drill 0.6)
  Top 0.406: RS_TRANS_11.A 72.26,88.55 70.36,90.46 R47.2 70.36,93.22 v71.12,93.98
  Bottom 0.406: v71.12,93.98 75.75,98.61 U$36.43
11_RX-
  Top 0.406: RS_TRANS_11.B 73.53,91.06 R47.1 73.16,93.47 74.48,94.8 U$36.44
11_TX+
  Top 0.406: RS_TRANS_11.Y 76.07,88.77 78.23,90.94 R48.1 78.29,91.49 U$36.41
11_TX-
  Top 0.406: RS_TRANS_11.Z 74.8,90.81 R48.2 75.44,92.74 77.02,94.32 U$36.42
12_RX+  (via drill 0.6)
  Top 0.406: RS_TRANS_12.A 61.63,88.71 59.69,90.65 59.69,91.31 R49.2 59.69,91.57 59.69,92.71 v60.96,93.98 | U$36.47 70.67,98.93 v70.64,98.9
  Bottom 0.406: v70.64,98.9 70.64,98.58 66.04,93.98 v60.96,93.98
12_RX-
  Top 0.406: RS_TRANS_12.B 62.9,90.9 R49.1 62.36,92.84 63.5,93.98 66.04,93.98 69.4,97.34 U$36.48
12_TX+
  Top 0.406: RS_TRANS_12.Y 65.44,88.61 67.6,90.78 R50.1 67.6,93 73.21,98.61 U$36.45
12_TX-
  Top 0.406: RS_TRANS_12.Z 64.17,90.81 R50.2 64.77,91.44 71.94,98.61 U$36.46
+3V3  (via drill 0.38, 0.5, 0.6, 0.61)
  Top 0.254: U$11.AVDD3 30.64,6.63 C34.1 | U$11.AVDD4 31.64,8.69 v31.91,8.41 31.88,8.38 31.88,8.13 30.61,6.86 30.61,6.61 C34.1 | U$11.AVDD5 33.63,11.57 v33.81,11.75 | v26.67,13.65 26.87,13.86 U$11.AVDD1 28.71,13.86 29.08,14.22 29.08,15.49 28.72,15.86 U$11.AVDD | U$11.AVDD2 27.12,12.36 26.67,11.91 26.67,10.16 v27.94,8.89 | 15.24,124.46 C43.1 | R70.1 11.43,128.27 12.7,128.27 13.97,129.54 20.32,129.54 20.32,128.27 U$2.VOUT | v31.75,85.09 30.48,85.09 R73.2 29.21,85.09 27.94,86.36 26.67,86.36 R7.2 | R17.1 40.64,26.67 40.64,24.13 R16.1 | 39.5,6.48 39.37,6.35 39.37,5.59 38.86,5.08 31.14,5.08 30.48,5.73 C34.1 | 39.5,6.48 40.64,7.62 C31.1 | JTAG_CON.2 48.26,38.1 50.8,38.1 JTAG_CON.1 | 5.08,30.48 5.21,30.48 12.7,30.48 13.97,29.21 13.97,26.67 16.51,24.13 16.51,20.32 17.78,19.05 C17.2 15.9,17.14 J3.6 | JP3.4 15.24,59.69 29.21,59.69 29.21,57.15 27.94,55.88 U$10.P$3 | 44.45,113.03 v44.2,113.03 41.91,113.03 41.91,120.65 RS_TRANS_5.VCC | RX_MUX_3.VCC 102.87,97.79 105.41,97.79 106.68,99.06 106.68,101.6 105.41,102.87 99.06,102.87 v99.06,102.62 | C47.1 93.98,67.31 v93.98,65.79 93.98,63.5 v100.33,57.15 | v82.55,71.12 82.55,72.39 81.66,73.28 81.66,73.97 TX_MUX_1.VCC | v93.98,78.74 93.98,80.01 TX_MUX_3.VCC | v76.2,43.18 74.93,41.91 | 93.98,8.89 v93.82,8.57 | 101.6,20.95 101.6,20.19 105.41,16.38 | 101.6,20.95 101.6,21.59 100.33,22.86 99.06,22.86 U3.6 | R4.2 102.87,12.7 104.14,13.97 111.76,13.97 113.03,12.7 113.67,12.7 v114.94,11.43 | 107.95,30.48 v107.95,30.73 | RS-485-8.VCC 115.82,12.89 115.82,15.75 115.19,16.38 105.41,16.38 | ALTIMETER.4 96.04,4.47 96.52,4.95 96.52,6.35 | 96.52,6.35 96.52,7.11 95.41,8.22 ALTIMETER.1
  Top 0.254: 96.52,6.35 100.08,6.35 100.33,6.6 IMU.3 | 102.74,4.36 IMU.8 | U1.61 67.59,45.34 v67.6,45.34 | U1.48 63.96,45.8 v64.26,46.1 65.15,46.1 65.91,45.34 67.56,45.34 | U1.40 62,49.81 v62.48,50.29 | v5.08,20.32 5.08,20.57 3.81,21.84 3.81,27.81 R14.2 | U3.4 101.36,21.19 101.6,20.95 | 105.41,16.38 v102.62,16.38 | U$11.VDD 35.83,13.36 35.56,13.08 35.56,11.05 v36.32,10.29 38.61,8 39.37,8 39.5,7.87 39.5,6.48 | TX_MUX_2.VCC 67.88,74.61 67.69,74.42 56.9,74.42 52.96,78.36 v52.07,78.36 | RS_TRANS_7.VCC 50.67,80.77 v50.8,80.64 | U4.20 19.29,81.3 19.05,81.53 16.76,81.53 v15.24,80.01 | RX_MUX_4.VCC 102.68,58.23 v103.38,58.93 | RS_TRANS_8.VCC v83.06,83.69 | TX_MUX_4.VCC 102.55,43.62 v103.38,44.45 | v22.1,77.34 25.91,77.34 R71.2 | v84.84,59.05 83.82,58.04 83.82,52.07 83.06,51.31 U1.89 | U1.22 64.08,59.87 C20.1 63.58,60.38 U1.23 63.58,57.48 63.5,57.4 62.29,57.4 61.02,58.67 59.69,58.67 59.31,58.29 52.7,58.29 51.94,59.05 46.99,59.05 46.86,59.18 46.86,60.42 BLUETOOTH.VIN | R67.2 97.73,30.35 C72.1 100.4,30.35 101.79,31.75
  Top 0.305: U1.75 74.57,42.27 74.93,41.91 76.58,41.91 76.71,41.78 v76.71,40.89 | IMU.3 102.49,6.6 102.74,6.35 102.74,5.97 | 102.74,5.97 102.87,6.1 104.39,6.1 104.65,5.84 104.65,5.21 104.75,5.1 IMU.13 107.71,5.1 C9.1 | 102.74,4.36 102.74,5.97 | v103.12,10.92 103.12,11.94 R4.2 | v107.95,30.73 107.95,31.5 107.7,31.75 101.79,31.75 | v15.49,88.65 17.91,86.23 17.91,83.44 19.05,82.3 22.1,82.3 22.35,82.55 22.35,83.95 21.08,85.22 21.08,86.74 21.21,86.87 22.1,86.87 23.24,88.01 26.16,88.01 R7.2 | R71.2 29.34,78.61 29.84,79.12 29.84,81.03 29.46,81.41 R72.2 | U1.8 71.07,59.49 70.74,59.82 64.14,59.82 64.08,59.87
  Top 0.406: RS-485-7.VCC 115.32,27.56 v114.94,27.94 | RS-485-8.VCC 115.19,11.18 v114.94,11.43 | RS_TRANS_6.VCC 32.89,121.79 v33.02,121.92 | RS_TRANS_5.VCC 41.78,121.79 v41.91,121.92 | RS_TRANS_10.VCC 50.67,121.79 v50.8,121.92 | RS_TRANS_9.VCC 59.72,120.62 59.69,120.65 v59.69,121.92 | RS_TRANS_4.VCC v68.58,121.92 | RS_TRANS_3.VCC v78.11,121.92 | RS_TRANS_2.VCC 87.5,121.79 v87.63,121.92 | RS_TRANS_1.VCC 100.62,107.19 v100.33,107.47 | RS_TRANS_7.VCC 50.67,83.69 v50.8,83.82 | RS_TRANS_12.VCC 61.63,83.22 v62.23,83.82 | RS_TRANS_11.VCC 72.26,83.69 v72.39,83.69 | U2.20 18.02,37.07 v17.14,37.94 16.41,37.21 U2.18 16.41,35.4 v17.02,34.8 | U2.6 17.21,45.63 v18.1,46.51 18.72,45.9 | U2.4 18.82,45.8 18.72,45.9 | BLUETOOTH.VIN 45.69,61.59 v43.97,61.59 | ALTIMETER.1 94.17,8.22 v93.82,8.57 | C30.A C31.1 | 5.08,29.08 R14.2 5.21,30.48 5.21,31.11 v5.08,31.24 | C10.1 C9.1 | L1.1 83.68,5.19 v84.84,6.35 | v27.69,46.48 27.69,47.24 24.13,50.8 v24.64,50.8 | v22.35,47.24 21.34,47.5 20.32,47.5 18.72,45.9 | v98.55,10.79 R3.2 | JP2.3 91.82,30.48 93.73,28.57 v94.61,28.57 | U3.18 92.61,23.59 v92.71,23.5 92.33,23.11 92.33,22.61 91.71,21.99 U3.20 | 18.16,119.13 18.16,119.25 | RX_MUX_2.VCC 26.13,101.63 v26.92,100.84 | v38.1,22.86 39.24,22.86 R16.1
  Top 0.61: RS-485-1.VCC v115.57,126.36 | RS-485-2.VCC v115.57,109.86 | RS-485-3.VCC v115.57,93.34 | RS-485-4.VCC 115.82,44.07 v115.57,44.45 | RS-485-5.VCC v115.57,60.33 | RS-485-6.VCC 115.7,76.96 v114.94,77.47 | v27.94,8.89 C35.1 | 18.16,119.13 14.99,115.95 12.83,115.95 12.32,115.44 12.32,113.03 10.41,111.12 RX_MUX_1.VCC 10.41,102.11 11.43,101.09 v11.43,100.84 | 18.16,119.25 18.16,124.33
  Top 0.813: 15.24,124.46 21.84,124.46 22.73,125.35 22.73,125.86 22.86,125.98 | 20.32,128.27 20.57,128.27 22.86,125.98 | 22.86,125.98 25.15,125.98 v27.94,123.19 27.94,110.49 24.13,106.68 24.13,100.84 v24.38,100.58
  Top 1.27: C34.1 C35.1 C29.A
  Bottom 0.254: v33.81,11.75 33.81,13.46 C33.1 | C32.1 24.58,11.43 25.4,11.43 26.67,12.7 v26.67,13.65 | 69.34,41.15 C21.1 69.85,40.64 69.85,21.59 41.91,21.59 34.29,13.97 C33.1 | 63.5,82.55 v62.23,83.82 | 63.5,82.55 71.12,82.55 v72.39,83.69 73.28,83.69 73.53,83.44 83.06,83.44 v83.06,83.69 83.06,85.73 C58.1 | 39.37,91.19 39.37,91.44 44.45,86.36 50.8,86.36 C56.1 | 63.5,82.55 63.5,78.74 55.88,78.74 v50.8,83.82 | 13.97,100.33 C45.1 | 25.4,93.98 25.53,94.11 | 27.94,100.33 24.13,100.33 v24.38,100.58 | 27.94,100.33 29.21,100.33 C49.1 | R69.2 34.29,76.2 34.29,81.28 35.56,82.55 35.56,85.09 v31.75,85.09 19.05,85.09 19.05,80.01 C76.1 | 19.05,88.9 C75.1 | 27.94,100.33 36.83,91.44 36.83,91.19 | C33.1 34.29,12.7 34.29,10.16 C36.1 33.78,9.02 33.18,8.41 v31.91,8.41 | C37.1 30.48,16.51 33.02,13.97 C33.1 | v38.1,22.86 33.02,17.78 29.21,17.78 | JTAG_CON.1 50.8,36.83 54.61,36.83 60.96,43.18 v60.71,43.18 60.71,44.96 61.98,46.23 64.14,46.23 | JP3.4 10.16,63.5 | 10.16,63.5 10.16,60.96 R6.1 | 35.56,55.88 43.18,48.26 R1.2 | 35.56,55.88 U$10.P$3 26.67,55.88 25.4,54.61 | 35.56,55.88 36.83,55.88 41.91,60.96 C28.2 | 16.51,34.29 45.72,34.29 48.26,36.83 JTAG_CON.2 | 13.97,31.75 36.66,31.77 36.66,31.75 36.78,31.75 38.1,30.43 | v15.24,80.01 11.43,76.2 11.43,67.31 2.54,67.31 1.27,66.04 1.27,63.5 10.16,63.5 | v33.02,121.92 34.29,120.65 40.64,120.65 | v41.91,121.92 40.64,120.65 | 49.53,120.65 v50.8,121.92 | 40.64,120.65 49.53,120.65 | v59.69,121.92 58.42,120.65 49.53,120.65 | 102.87,110.49 100.33,107.95 v100.33,107.47 | 102.87,110.49 111.76,110.49 113.03,109.22 C65.1 114.3,109.22 120.65,102.87 120.65,93.47 119.38,92.2 | 86.36,125.73 80.01,125.73 78.74,124.46 C48.1
  Bottom 0.254: 86.36,125.73 87.63,124.46 C46.1 | 71.12,125.73 69.85,124.46 C50.1 | 71.12,125.73 77.22,125.73 77.47,125.73 v77.15,125.89 | 86.36,125.73 102.87,125.73 | 102.87,125.73 113.03,125.73 C64.1 | 102.87,125.73 102.87,110.49 | 71.12,125.73 62.23,125.73 60.96,124.46 C60.1 | 100.33,58.42 97.79,58.42 97.79,48.26 101.6,44.45 C57.1 | 100.33,58.42 101.6,59.69 C59.1 | 93.98,77.47 v93.98,65.79 92.46,64.26 91.82,64.26 88.27,60.71 85.85,60.71 | 99.06,77.47 101.6,77.47 104.14,80.01 C53.1 | 99.06,77.47 93.98,77.47 | 93.98,77.47 v93.98,78.74 | C51.1 72.39,72.39 80.01,64.77 81.28,64.77 82.55,66.04 v82.55,71.12 85.34,68.33 85.34,61.21 85.85,60.71 | 99.06,77.47 99.06,100.33 C55.1 | v100.33,57.15 100.33,58.42 | v76.2,43.18 73.66,40.64 73.66,36.83 83.82,36.83 90.17,30.48 JP2.3 | 93.98,8.89 93.85,8.64 v93.82,8.57 | C70.1 113.03,26.67 118.11,26.67 118.11,17.78 R2.2 118.11,16.51 121.92,16.51 121.92,13.97 120.65,12.7 115.57,12.7 114.3,11.43 | 115.57,60.96 114.3,59.69 C68.1 | 115.57,92.71 114.3,92.71 C66.1 | v112.01,30.73 111.76,30.48 111.76,43.18 113.03,43.18 C67.1 | 98.93,101.6 106.68,101.6 115.57,92.71 | 64.14,46.23 v64.26,46.1 | 64.14,46.23 64.26,46.23 64.26,48.51 v62.48,50.29 | v86.74,123.7 87.41,123.7 87.63,123.48 | 115.57,92.71 118.87,92.71 119.38,92.2 | 119.38,92.2 119.38,76.96 119.13,76.71 | v102.62,16.38 102.62,18.29 97.41,23.5 | 33.02,123.19 v27.94,123.19 | 33.02,123.19 36.83,127 114.3,127 124.46,116.84 124.46,13.97 115.57,5.08 109.22,5.08 101.6,12.7 101.6,19.05 97.79,22.86 C41.1 | 33.02,123.19 C54.1 | v52.07,78.36 51.18,78.36 50.8,78.74 v50.8,80.64 | v84.84,59.05 84.84,59.69 85.85,60.71 | 38.12,22.86 38.1,30.42 38.1,30.43
  Bottom 0.254: 38.1,30.43
  Bottom 0.305: 17.02,38.07 v17.14,37.94 | v107.95,30.73 v112.01,30.73 114.05,30.73 115.06,29.72 115.06,28.07 | 69.34,41.15 69.34,33.02 v73.15,29.21 | v98.55,10.79 103,10.79 v103.12,10.92
  Bottom 0.406: v33.02,121.92 33.02,123.19 33.02,123.48 C54.1 | v41.91,121.92 41.91,123.48 C52.1 | v50.8,121.92 50.8,123.48 C61.1 | v59.69,121.92 59.69,123.32 C60.1 | v68.58,121.92 68.58,123.32 C50.1 | v78.11,121.92 78.11,123.32 C48.1 | v87.63,121.92 87.63,123.48 C46.1 | v100.33,107.47 98.45,107.47 C44.1 | v50.8,83.82 50.8,85.86 C56.1 | v62.23,83.82 62.23,86.07 C63.1 | v72.39,83.69 72.39,85.86 C62.1 | C73.1 17.02,45.43 v18.1,46.51 | v43.97,61.59 C28.2 | v93.82,8.57 93,7.75 C7.1 C5.1 86.24,7.75 v84.84,6.35 | R15.2 5.21,20.19 v5.08,20.32 | v5.08,31.24 13.46,31.24 13.97,31.75 16.51,34.29 v17.02,34.8 | R1.2 43.18,44.96 v42.93,44.7 | R68.2 28.19,46.99 v27.69,46.48 | v22.35,47.24 v24.64,50.8 25.4,51.56 25.4,54.61 v25.4,55.37 | 69.34,41.15 69.34,43.69 67.69,45.34 v67.6,45.34 | v115.57,44.45 120.14,49.02 120.14,59.69 119.38,60.45 115.57,60.45 115.57,60.96 115.57,62.23 119.63,66.29 119.63,76.2 119.13,76.71 118.87,76.96 115.44,76.96 v114.94,77.47 | 117.35,44.07 119.13,44.07 120.27,42.93 120.27,33.27 v114.94,27.94 | 13.97,100.33 13.97,94.74 14.73,93.98 19.05,93.98 | 25.4,93.98 19.05,93.98 | 19.05,93.98 19.05,88.9 | 93.85,8.64 93.85,10.29 94.36,10.79 v98.55,10.79 | v94.61,28.57 91.13,25.21 C40.1 92.52,23.5 v92.71,23.5 92.71,25.02 93.22,25.53 96.14,25.53 97.28,24.38 C41.1 | v31.24,75.69 29.72,75.69 27.81,77.6 22.35,77.6 v22.1,77.34 | v38.1,22.86 38.12,22.86
  Bottom 0.61: v115.57,126.36 114.17,126.36 C64.1 | v115.57,109.86 114.17,109.86 C65.1 | v115.57,93.34 114.17,93.34 C66.1 | v115.57,44.45 114.94,44.45 114.3,43.81 114.17,43.81 C67.1 | v115.57,60.33 114.17,60.33 C68.1 | v114.94,77.47 114.17,77.47 C69.1 | C70.1 114.17,27.94 v114.94,27.94 115.06,28.07 | v114.94,11.43 114.3,11.43 113.53,11.43 C71.1 | C32.1 25.27,8.89 v27.94,8.89 | C74.1 17.02,38.07 | v103.38,44.45 102.36,44.45 C57.1 | C59.1 102.62,59.69 v103.38,58.93 | C48.1 77.85,123.83 77.22,124.46 77.22,125.73 77.22,125.98 | C37.1 30.13,16.86 29.21,17.78 28.45,18.54 v28.45,19.05 | C49.1 26.96,100.81 v26.92,100.84 | C45.1 11.46,100.81 v11.43,100.84 | C75.1 15.56,88.58 v15.49,88.65 | C76.1 15.56,80.33 v15.24,80.01 | v31.75,85.09 31.75,87.88 25.53,94.11 25.4,94.23 25.4,96.52 24.89,97.03 24.89,99.31 24.38,99.82 v24.38,100.58 | v37.85,111.51 42.67,111.51 v44.2,113.03 | R69.2 31.27,75.72 v31.24,75.69
  Bottom 0.813: v36.32,91.19 36.83,91.19 39.37,91.19 v40.13,91.19 | C55.1 98.93,101.6 98.93,102.49 v99.06,102.62 | v76.71,40.89 v76.71,38.86
  Bottom 1.016: R6.1 12.32,60.33 v13.21,61.21 | v103.89,81.79 103.89,80.39 C53.1
  Bottom 1.676: C74.1 C73.1
+5V
  Top 1.016: U$2.VIN 13.32,126.1 11.68,124.46 11.68,124.41 11.18,123.91
  Top 1.27: JP1.2 11.18,123.91 11.61,123.91 C42.1
+12V
  Top 1.27: JP8.2 JP10.2 JP4.2 5.11,91.15 2.29,93.98 2.29,98.3 3.05,99.06 JP11.2 2.54,99.06 2.03,99.57 2.03,107.52 JP7.2 6.69,110.57 R5.1
ACT_LED  (via drill 0.5)
  Top 0.254: U$11.ACTLED 38.58,12.86 v39.05,12.38
  Bottom 0.254: v39.05,12.38 39.05,9.84 34.29,5.08 19.05,5.08 8.26,15.88 4.45,15.88 3.81,15.24 3.81,14.61 2.02,12.81 J3.12
ALT_INT1
  Top 0.406: ALTIMETER.6 98.42,5.72 99.54,4.6 99.54,3.02 98.74,2.22 89.85,2.22 88.74,3.33 88.74,18.73 89.6,19.59 U3.23
ALT_INT2
  Top 0.406: ALTIMETER.5 98.39,4.47 98.74,4.13 98.74,3.49 98.27,3.02 90.33,3.02 89.53,3.81 89.53,18.41 89.91,18.79 U3.24
AT328_MISO  (via drill 0.5)
  Top 0.254: U1.12 69.09,56.71 68.74,56.36 64.45,56.36 v63.98,55.88
  Bottom 0.254: JP15.1 19.21,67.79 23.97,67.79 25.56,66.2 51.59,66.2 60.01,57.78 63.34,57.78 63.98,57.15 v63.98,55.88 63.98,52.07 71.91,44.13 71.91,34.29 76.52,29.69 85.41,29.69 87.95,27.15 87.95,25.72 JP19.1
AT328_MOSI  (via drill 0.5)
  Top 0.254: U1.13 68.58,57.15 68.26,56.83 63.25,56.83 v62.99,56.58
  Bottom 0.254: JP16.1 13.97,69.85 16.51,67.31 23.65,67.31 25.24,65.72 51.28,65.72 60.17,56.83 62.74,56.83 v62.99,56.58 62.87,56.45 62.87,52.39 71.44,43.81 71.44,33.97 76.2,29.21 83.82,29.21 JP18.1
AT328_SCK  (via drill 0.5)
  Top 0.254: U1.11 69.57,56.24 69.22,55.88 66.2,55.88 v65.56,55.24
  Bottom 0.254: JP17.1 21.27,68.26 24.29,68.26 25.88,66.67 51.91,66.67 60.17,58.42 63.5,58.42 65.56,56.36 v65.56,55.24 64.52,54.2 64.52,52.32 72.39,44.45 72.39,34.61 76.83,30.16 85.72,30.16 88.42,27.46 88.42,23.5 JP20.1
AT328_SCL
  Top 0.254: IMU.23 102.75,9.64 99.56,12.83 R4.1 99.56,9.39 98.39,8.22 ALTIMETER.8
  Top 0.406: U3.28 94.85,14.05 96.2,12.7 R4.1
AT328_SDA
  Top 0.254: IMU.24 102.25,8.87 101.92,9.21 101.28,9.21 99.05,6.97 ALTIMETER.7 97.42,6.97 96.52,7.87 96.52,8.64 94.36,10.79 R3.1
  Top 0.406: U3.27 94.05,10.91 R3.1
AT_FAN_RST  (via drill 0.5, 0.6)
  Top 0.254: U1.99 74.73,56.31 74.3,55.88 74.3,54.99 73.15,53.85 68.77,53.85 v68.58,53.66 68.64,53.59 | 30.23,77.95 30.23,78.74 30.99,79.5 30.99,82.55 30.48,83.06 26.29,83.06 24.49,84.86 U4.29
  Top 0.61: J5.5 29.06,77.95 30.23,77.95 328_FAN_RST.1 328_FAN_RST.2 39.29,77.47 40.89,77.47 41.66,76.71 41.66,75.95 41.4,75.69 v40.39,75.69
  Bottom 0.254: v68.58,53.66 68.58,54.93 63.82,59.69 60.48,59.69 52.55,67.63 37.78,67.63 35.56,69.85 35.56,74.32 R69.1
  Bottom 0.61: R69.1 40.35,75.72 v40.39,75.69
AT_RST  (via drill 0.5)
  Top 0.254: v95.25,21.11 95.65,20.71 U3.29 95.65,14.21 96.2,13.65 97.63,13.65 98.86,14.88 328_RST.2 | J1.5 73.66,24.13 | v72.07,57.02 71.58,57.26 U1.7 | v72.39,51.05 72.14,51.31 68.2,51.31 67.94,51.05 v67.94,50.04
  Top 0.305: v73.66,35.56 73.66,33.27 71.88,31.5 71.88,25.91 73.66,24.13
  Bottom 0.254: v95.25,21.11 94.14,20 77.79,20 J1.5 | v73.66,35.56 72.87,36.35 72.87,45.12 v67.94,50.04 | R2.1 115.44,16.74 328_RST.2 328_RST.1 | 71.88,53.59 71.88,56.58 v72.07,57.02
  Bottom 0.305: v72.39,51.05 71.75,51.69 71.75,53.47 71.88,53.59
AT_STR_RST  (via drill 0.5, 0.6)
  Top 0.254: U1.100 74.32,56.79 73.79,56.26 73.79,55.12 73.28,54.61 68.33,54.61 67.56,53.85 64.58,53.85 61.98,56.45 61.98,57.15 61.72,57.4 56.57,57.4 v56.39,57.35
  Top 0.406: U2.29 24.37,41.04 v24.45,41.12
  Bottom 0.254: v56.39,57.35 56.39,54.23 55.75,53.59 55.75,51.69 56.64,50.8 56.64,47.24 54.61,45.21 52.83,45.21 51.44,43.81 40.69,43.81 328_STR_RST.2 35.28,49.25 35.31,49.28
  Bottom 0.406: v24.45,41.12 26.89,41.12 J4.5 27.3,42.55 26.67,43.18 26.67,47.17 328_STR_RST.1 328_STR_RST.2 35.26,48.78 R68.1
ATCLK1
  Top 0.406: U3.7 101.03,23.59 Y2.2 105.22,19.4 C4.1
ATCLK2
  Top 0.406: U3.8 102.34,24.39 Y2.1 105.22,27.28 C3.1
ATCLK3
  Top 0.406: U2.8 15.62,47.57 Y4.1
  Bottom 0.406: Y4.1 13.34,52.26 C22.1
ATCLK4
  Top 0.406: U2.7 16.41,47.85 Y4.2
  Bottom 0.305: 18.41,52.04 C23.1
  Bottom 0.406: Y4.2 18.41,52.04
ATCLK5
  Top 0.305: U4.8 16.89,91.06 Y5.1
  Bottom 0.305: Y5.1 12.2,92.71 C24.1
ATCLK6
  Top 0.305: U4.7 17.68,90.08 Y5.2
  Bottom 0.305: Y5.2 23.36,92.71 C25.1
BLUETH_CTS  (via drill 0.5)
  Top 0.254: U1.4 73.08,57.1 v73.25,56.93 | v49.4,68.45 46.99,66.04 BLUETOOTH.CTS
  Bottom 0.254: v73.25,56.93 72.55,57.63 72.55,61.44 72.07,61.91 59.05,61.91 52.86,68.1 49.75,68.1 v49.4,68.45
BLUETH_RST
  Top 0.254: R18.1 47.12,56.52 56.83,56.52 59.55,53.8 U1.32
BLUETH_RTS  (via drill 0.5)
  Top 0.254: U1.3 73.58,61.2 v73.5,61.28 | v47.82,68.45 46.9,67.54 BLUETOOTH.RTS
  Bottom 0.254: v73.5,61.28 72.39,62.39 59.37,62.39 52.23,69.53 48.9,69.53 v47.82,68.45
BLUETH_RXD  (via drill 0.5)
  Top 0.254: U1.1 74.57,59.33 v75.41,60.17 | v47.56,70.01 47.56,69.79 46.86,69.09 45.79,69.09 BLUETOOTH.RXD
  Bottom 0.254: v75.41,60.17 74.45,61.12 74.45,61.59 73.18,62.87 59.69,62.87 52.55,70.01 v47.56,70.01
BLUETH_TXD  (via drill 0.5)
  Top 0.254: U1.2 74.09,60.28 v75.41,61.44 | BLUETOOTH.TXD 45.74,72.37 44.47,72.37 v44.2,72.64
  Bottom 0.254: v75.41,61.44 73.5,63.34 60.01,63.34 50.96,72.39 44.45,72.39 v44.2,72.64
CLKI  (via drill 0.5)
  Top 0.305: U1.50 58.63,44.81 Y6.3
  Top 0.406: v55.56,42.86 55.67,42.97 Y6.3
  Bottom 0.406: C2.1 54.1,42.86 v55.56,42.86
CLKO  (via drill 0.5)
  Top 0.305: U1.51 62.59,42.27 59.69,39.37 59.2,39.37 Y6.1
  Top 0.406: v59.05,37.47 59.09,37.5 Y6.1
  Bottom 0.406: C1.1 59.05,36.06 v59.05,37.47
ETH_RXN  (via drill 0.5)
  Top 0.254: U$11.RXN 27.03,15.36 v26.35,16.03
  Bottom 0.254: v26.35,16.03 26.35,16.83 20.93,22.25 R12.1 20.29,22.23 J3.2
ETH_RXP  (via drill 0.5)
  Top 0.254: U$11.RXP 25.97,14.86 v25.88,14.76
  Bottom 0.254: v25.88,14.76 26.83,14.76 27.46,15.4 27.46,17.78 21.59,23.65 18.13,23.65 R13.1 12.87,24 J3.1
ETH_TXN
  Top 0.254: U$11.TXN 24.98,17.36 21.72,14.1 R10.1 15.41,14.1 J3.8
ETH_TXP  (via drill 0.5)
  Top 0.254: U$11.TXP 25.75,16.86 v24.77,15.88
  Bottom 0.254: v24.77,15.88 17.91,15.88 R11.1 17.65,15.88 J3.7
EXT_TEMP_DATA
  Top 0.254: U3.9 98.04,27.56 95.38,30.23 95.06,30.23 R67.1 93.41,30.42 JP2.2
FAN_AT328_SS  (via drill 0.5)
  Top 0.254: U1.10 70.08,55.95 69.53,55.4 67.09,55.4 v66.8,55.12 | v26.67,67.94 26.04,68.58 13.49,68.58 11.91,70.17 11.91,81.44 13.72,83.25 U4.14
  Bottom 0.254: v26.67,67.94 26.99,67.94 27.78,67.15 52.23,67.15 60.33,59.05 63.66,59.05 65.79,56.93 65.79,56.9 66.8,55.88 v66.8,55.12
FAN_PWM_OC0A  (via drill 0.5)
  Top 0.406: U4.10 12.76,86.45 v12.22,87
  Bottom 0.254: v12.22,87 10.79,87 8.89,85.09 8.89,76.2 JP8.4
FAN_PWM_OC0B
  Top 0.406: JP11.4 7.62,100.97 7.62,96.52 13.97,90.17 13.97,87.63 14.35,87.25 U4.9
FAN_PWM_OC1A
  Top 0.406: U4.13 12.46,84.06 10.16,86.36 10.16,90.04 JP4.4
FAN_PWM_OC2B  (via drill 0.5)
  Top 0.406: U4.31 22.64,86.45 v22.07,85.88
  Bottom 0.406: v22.07,85.88 13.53,85.88 JP10.4
FAT328_JMP_MISO
  Top 0.254: JP15.2 16.19,73.03 15.24,73.98 15.24,77.31 13.34,79.22 13.34,80.64 14.35,81.66 U4.16
FAT328_JMP_MOSI
  Top 0.254: JP16.2 12.38,74.61 12.38,81.12 13.72,82.45 U4.15
FAT328_JMP_SCK
  Top 0.254: JP17.2 17.78,74.3 17.78,76.52 16.89,77.41 U4.17
FAT328_P_MISO
  Bottom 0.254: JP15.3 17.4,74.3 22.23,74.3 22.73,73.79 25.27,73.79 25.4,73.66 25.4,71.75 J5.1
FAT328_P_MOSI
  Bottom 0.254: JP16.3 15.24,74.3 15.24,72.39 15.88,71.75 23.37,71.75 J5.4
FAT328_P_SCK
  Top 0.254: JP17.3 20.57,73.79 26.07,73.79 26.67,73.18 J5.3
GND  (via drill 0.5, 0.6)
  Top 0.254: U$11.AGND2 30.14,9.18 v29.53,8.57 | U$11.AGND4 32.63,11.34 32.07,11.91 v30.96,11.91 31.14,11.73 U$11.AGND3 | 105.41,2.54 104.25,3.69 IMU.11 104.27,4.36 104.27,4.95 104.14,5.08 103.38,5.08 103.25,4.96 IMU.9 | 105.41,2.54 105.41,1.77 C8.2 | U$11.GND 39.48,13.86 40.64,12.7 40.64,10.29 C31.2 | U1.49 62.15,45.29 v62.74,44.7 66.42,44.7 67.06,44.07 67.06,43.18 U1.60 | 105.41,2.54 105.41,2.79 v106.43,3.81 | 106.68,8.89 v106.93,9.14 | 106.67,7.1 106.68,7.11 | U$11.AGND1 28.81,13.36 29.46,12.7 29.46,11.81 v29.53,11.75 | U$11.AGND 32.16,16.36 v32.51,16 | U$11.AGND5 29.64,19.39 28.96,20.07 v26.92,20.07 | U5.4 35.97,80.61 v36.32,80.26 | U5.2 32.86,81.12 v32.38,81.47 | RX_MUX_3.GND 88.9,89.15 88.27,88.52 88.27,87.76 v89.15,86.87 | U1.41 56.77,49.3 56.41,49.78 55.27,49.78 54.81,49.2 54.81,48.51 53.06,46.76 53.06,38.1 v53.34,37.82 | 59.67,60.37 60.2,60.89 C20.2 62.59,58.57 U1.25 U1.24 | IMU.15 105.29,6.1 105.28,6.1 | v68.71,83.82 69.6,84.58 75.47,84.58 v75.72,84.33 75.98,84.58 84.07,84.58 84.71,83.95 v84.71,83.69 | 65.41,81.92 65.41,82.2 RS_TRANS_12.GND | v58.29,76.45 58.29,76.2 57.53,75.44 | 65.41,77.85 65.41,78.23 v64.9,78.74 | v86.87,62.1 88.01,60.96 88.01,54.48 84.07,50.55 82.04,50.55 81.66,50.8 U1.88 74.42,50.8 72.39,48.77 70.83,48.77 v70.8,48.74 70.77,48.74 70.74,48.77 70.74,47.37 72.77,45.34 73.28,45.34 74.09,44.53 U1.74 | v48.51,62.48 48.51,64.39 50.93,66.8 50.93,68.07 44.83,74.17 42.42,74.17 v42.29,74.3 | C72.2 105.03,30.35 v105.16,30.23 | C77.2 23.88,89.53 v23.37,90.04
  Top 0.305: IMU.18 106.41,7.6 106.68,7.87 | 106.68,7.87 106.68,8.89 | IMU.15 106.18,6.1 106.68,6.6 106.68,7.11 106.68,7.87 | IMU.17 106.67,7.1 | U1.74 74.09,41.99 74.93,41.15 v75.44,40.83 | IMU.1 103.65,7.6 v104.14,7.11 | 65.41,81.92 65.41,77.85 62.99,75.44 57.53,75.44 54.48,78.49 54.48,82.42 | U1.9 70.59,56.29 71.25,55.63 v72.77,55.63 | v74.68,52.32 74.68,51.05 74.42,50.8